# Altium schematic sheet RF_Antenna.SchDoc
size A4; SheetNumber: 6; SheetTotal: 8
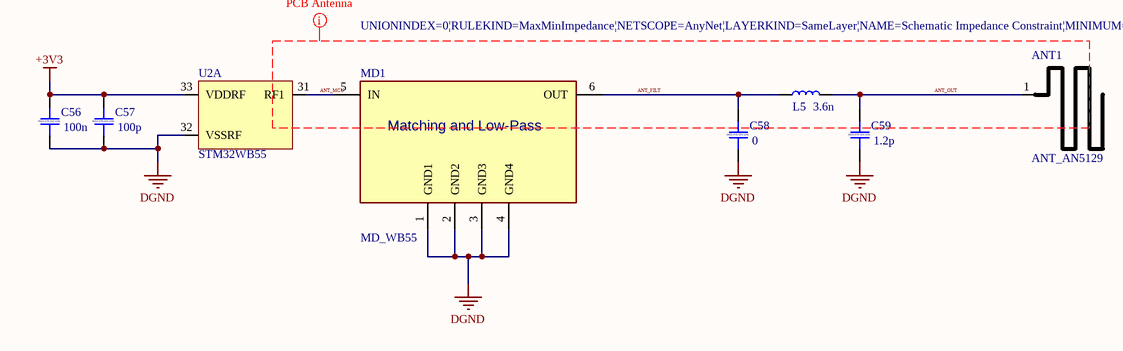
[diagram p0: RF_Antenna.SchDoc]

## Parts
ANT1  ANT_AN5129  [ANT_AN5129-Footprint-1]
C56  100n  [CAP_0603]
C57  100p  [CAP_0603]
C58  0  [CAP_0603]
C59  1.2p  [CAP_0603]
L5  3.6n  [IND_0603]
MD1  MD_WB55  [FP-MLPF-WB55-01E3-MFG]
U2  STM32WB55  [QFN40P800X800X100_HS-69N]  (part A of 5)

## Nets
+3V3: C56.1 C57.1 U2.33(VDDRF)
DGND: C56.2 C57.2 C58.2 C59.2 MD1.1(GND1) MD1.2(GND2) MD1.3(GND3) MD1.4(GND4) U2.32(VSSRF)
ANT_FILT: C58.1 L5.1 MD1.6(OUT)
ANT_MCU: MD1.5(IN) U2.31(RF1)
ANT_OUT: ANT1.1 C59.1 L5.2

## Layout directives
rule Impedance Constraint [Min = 45.00    Max = 55.00    ]: ANT_FILT, ANT_MCU, ANT_OUT

## Notes on the sheet
- (in symbol CMP-001-00113-3) 0603 X7R 50V 10%
- (in symbol CMP-00025-00004-1) Matching and Low-Pass

## Library data of the parts
ANT1 = CMP-00025-00003-3: PCB Antenna from ST AN5129
C56-C59 = CMP-001-00113-3: Capacitor SMD 0603; Manufacturer: *; Rating: *; Distributor Link: *; Source: Schematic-Lib-PhilsLab.SchLib; Manufacturer Part Number: *; Dielectric: *; LCSC: *; Design Item ID: CAP_0603
L5 = CMP-006-00026-1: Inductor SMD 0603; Design Item ID: IND_0603; Source: Schematic-Lib-PhilsLab.SchLib
MD1 = CMP-00025-00004-1: Low Pass Filter
U2 = CMP-031-00230-3: Multiprotocol wireless 32-bit MCU Arm®-based Cortex®-M4